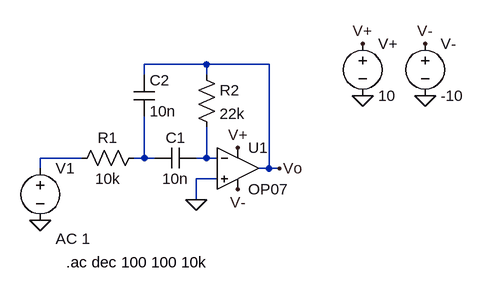
[diagram p0: schematic Final.asc]
Final.asc, the LTspice schematic file:
Version 4
SHEET 1 880 680
WIRE 208 -64 112 -64
WIRE 304 -64 208 -64
WIRE 112 -48 112 -64
WIRE 208 -48 208 -64
WIRE 16 80 -48 80
WIRE 112 80 112 16
WIRE 112 80 96 80
WIRE 128 80 112 80
WIRE 208 80 208 32
WIRE 208 80 192 80
WIRE 224 80 208 80
WIRE -48 96 -48 80
WIRE 304 96 304 -64
WIRE 304 96 288 96
WIRE 320 96 304 96
WIRE 224 112 192 112
WIRE 192 144 192 112
FLAG 448 -16 0
FLAG 544 -16 0
FLAG 192 144 0
FLAG 448 -96 V+
FLAG 256 64 V+
FLAG 544 -96 V-
FLAG 256 128 V-
FLAG -48 176 0
FLAG 320 96 Vo
SYMBOL voltage -48 80 R0
WINDOW 123 24 124 Left 2
WINDOW 39 0 0 Left 0
SYMATTR Value2 AC 1
SYMATTR InstName V1
SYMATTR Value ""
SYMBOL voltage 448 -112 R0
WINDOW 123 0 0 Left 0
WINDOW 39 0 0 Left 0
SYMATTR InstName V+
SYMATTR Value 10
SYMBOL voltage 544 -112 R0
WINDOW 123 0 0 Left 0
WINDOW 39 0 0 Left 0
SYMATTR InstName V-
SYMATTR Value -10
SYMBOL OpAmps\\OP07 256 32 R0
SYMATTR InstName U1
SYMBOL res 112 64 R90
WINDOW 0 0 56 VBottom 2
WINDOW 3 32 56 VTop 2
SYMATTR InstName R1
SYMATTR Value 10k
SYMBOL cap 192 64 R90
WINDOW 0 0 32 VBottom 2
WINDOW 3 32 32 VTop 2
SYMATTR InstName C1
SYMATTR Value 10n
SYMBOL cap 96 -48 R0
SYMATTR InstName C2
SYMATTR Value 10n
SYMBOL res 192 -64 R0
SYMATTR InstName R2
SYMATTR Value 22k
TEXT -8 240 Left 2 !.ac dec 100 100 10k

The netlist it stands for:
* Final.asc
V1 N001 0 AC 1
V+ V+ 0 10
V- V- 0 -10
XU1 0 N003 V+ V- Vo LT1001  ; OP07, pins In+ In- V+ V- OUT
R1 N002 N001 10k
C1 N003 N002 10n
C2 Vo N002 10n
R2 Vo N003 22k
.ac dec 100 100 10k
.lib LTC.lib
.backanno
.end